# Altium project G38TPS40200CC.PrjPcb
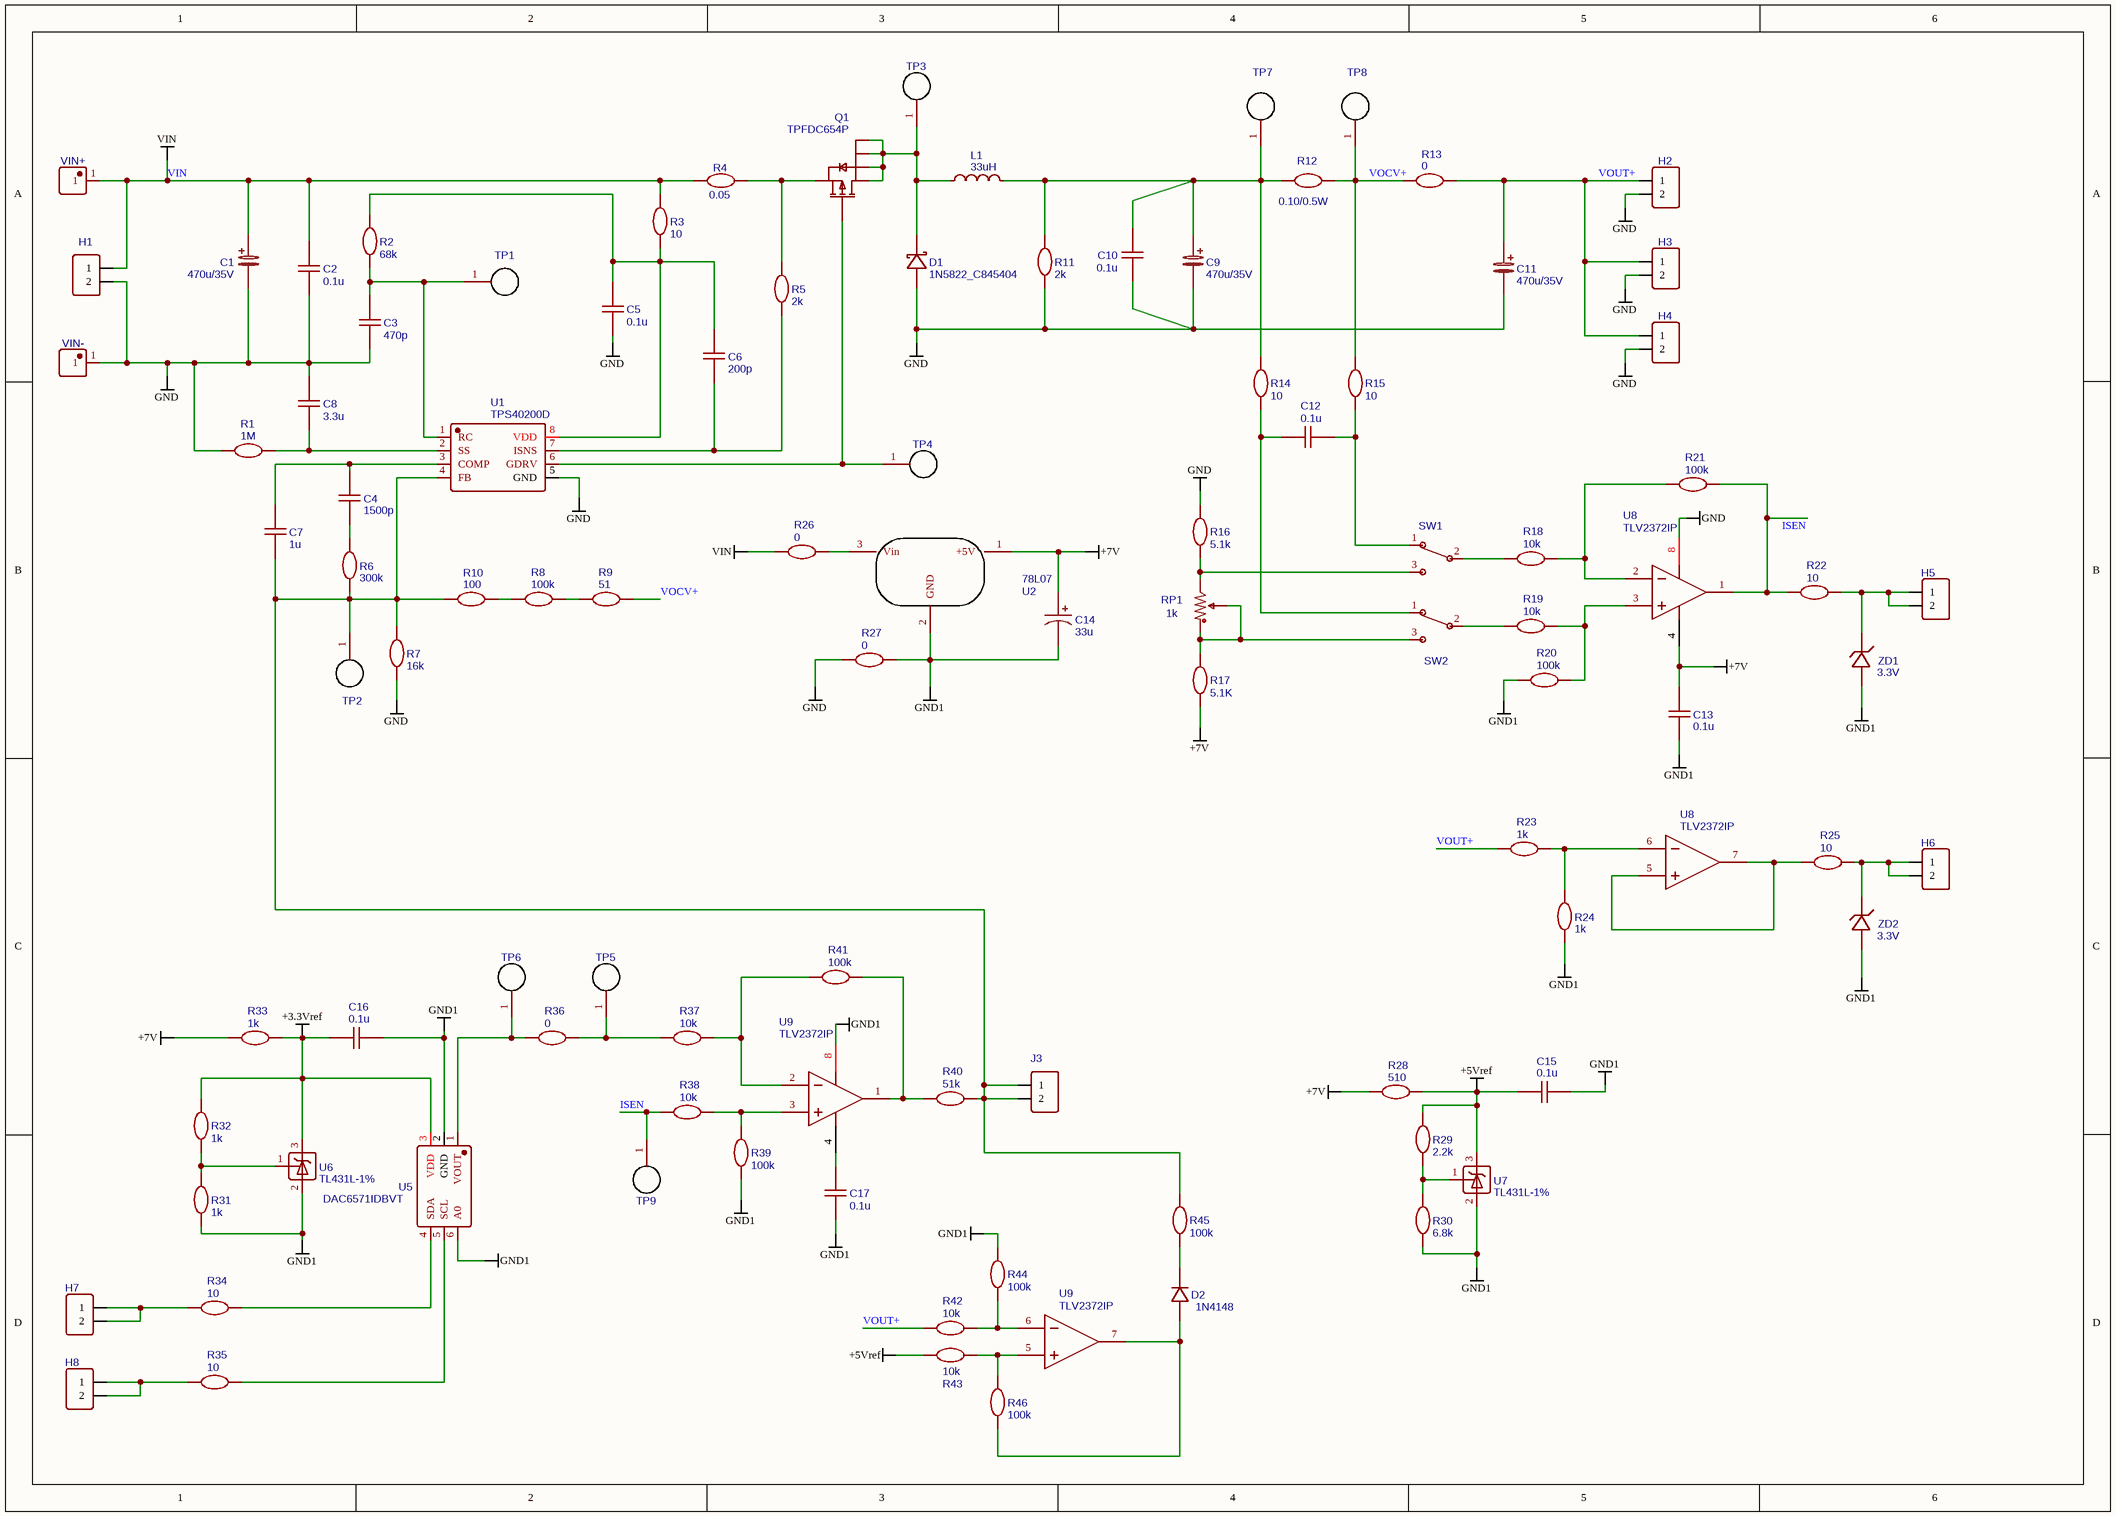
[diagram p0: G38TPS40200CC.schdoc]
1 sheet, 101 parts. Net scope: global (net labels, ports and power ports of the same name join across sheets).
Board file: G38TPS40200CC.pcbdoc

## Sheet G38TPS40200CC.schdoc
size 396 x 283 mm

### Parts
(Parts that share a designator on the sheet are numbered #1, #2 ... from top to bottom, then left to right.)
C1  470u/35V  [470UF/50V]
C2  0.1u  [C0805]
C3  470p  [C0805]
C4  1500p  [C0805]
C5  0.1u  [C0805]
C6  200p  [C0805]
C7  1u  [C0805]
C8  3.3u  [C0805]
C9  470u/35V  [470UF/50V]
C10  0.1u  [C0805]
C11  470u/35V  [470UF/50V]
C12  0.1u  [C0805]
C13  0.1u  [C0805]
C14  33u  [33UF/50V]
C15  0.1u  [C0805]
C16  0.1u  [C0805]
C17  0.1u  [C0805]
D1  1N5822_C845404  [DO-27_BD5.3-L8.4-P12.40-D1.3-RD]
D2  1N4148  [DO-35_BD2.0-L4.2-P8.20-D0.5-RD]
H1  HDR-F-2.54_1x2  [CONN-TH_P5.08_2EDGV-5.08-02P-14-100A-H]  (value not drawn)
H2  HDR-F-2.54_1x2  [CONN-TH_P5.08_2EDGV-5.08-02P-14-100A-H]  (value not drawn)
H3  HDR-F-2.54_1x2  [CONN-TH_P5.08_2EDGV-5.08-02P-14-100A-H]  (value not drawn)
H4  HDR-F-2.54_1x2  [CONN-TH_P5.08_2EDGV-5.08-02P-14-100A-H]  (value not drawn)
H5  HDR-F-2.54_1x2  [HDR-F-2.54_1X2]  (value not drawn)
H6  HDR-F-2.54_1x2  [HDR-F-2.54_1X2]  (value not drawn)
H7  HDR-F-2.54_1x2  [HDR-F-2.54_1X2]  (value not drawn)
H8  HDR-F-2.54_1x2  [HDR-F-2.54_1X2]  (value not drawn)
J3  HDR-F-2.54_1x2  [HDR-F-2.54_1X2]  (value not drawn)
L1  33uH  [IND-SMD_L7.0-W7.0_SMDRI74-330MT]
Q1  TPFDC654P  [SOT-23-6_L2.9-W1.6-P0.95-LS2.8-BL]
R1  1M  [R0805]
R2  68k  [R0805]
R3  10  [R0805]
R4  0.05  [R2512]
R5  2k  [R0805]
R6  300k  [R0805]
R7  16k  [R0805]
R8  100k  [R0805]
R9  51  [R0805]
R10  100  [R0805]
R11  2k  [R0805]
R12  0.10/0.5W  [R2512]
R13  0  [R0805]
R14  10  [R0805]
R15  10  [R0805]
R16  5.1k  [R0805]
R17  5.1K  [R0805]
R18  10k  [R0805]
R19  10k  [R0805]
R20  100k  [R0805]
R21  100k  [R0805]
R22  10  [R0805]
R23  1k  [R0805]
R24  1k  [R0805]
R25  10  [R0805]
R26  0  [R0805]
R27  0  [R0805]
R28  510  [R0805]
R29  2.2k  [R0805]
R30  6.8k  [R0805]
R31  1k  [R0805]
R32  1k  [R0805]
R33  1k  [R0805]
R34  10  [R0805]
R35  10  [R0805]
R36  0  [R0805]
R37  10k  [R0805]
R38  10k  [R0805]
R39  100k  [R0805]
R40  51k  [R0805]
R41  100k  [R0805]
R42  10k  [R0805]
R43  10k  [R0805]
R44  100k  [R0805]
R45  100k  [R0805]
R46  100k  [R0805]
RP1  1k  [RES-ADJ-TH_3P-L9.7-W5.0-P2.54]
SW1  CS12ANW03  [HDR-M-2.54_1X3]  (value not drawn)
SW2  CS12ANW03  [HDR-M-2.54_1X3]  (value not drawn)
TP1  1625854-2  [TESTPOINT-TH_Z2-1.5-8-2.5]  (value not drawn)
TP2  1625854-2  [TESTPOINT-TH_Z2-1.5-8-2.5]  (value not drawn)
TP3  1625854-2  [TESTPOINT-TH_Z2-1.5-8-2.5]  (value not drawn)
TP4  1625854-2  [TESTPOINT-TH_Z2-1.5-8-2.5]  (value not drawn)
TP5  1625854-2  [TESTPOINT-TH_Z2-1.5-8-2.5]  (value not drawn)
TP6  1625854-2  [TESTPOINT-TH_Z2-1.5-8-2.5]  (value not drawn)
TP7  1625854-2  [TESTPOINT-TH_Z2-1.5-8-2.5]  (value not drawn)
TP8  1625854-2  [TESTPOINT-TH_Z2-1.5-8-2.5]  (value not drawn)
TP9  1625854-2  [TESTPOINT-TH_Z2-1.5-8-2.5]  (value not drawn)
U1  TPS40200D  [SOIC-8_L4.9-W3.9-P1.27-LS6.0-BL]
U2  78L07  [TO-92]
U5  DAC6571IDBVT  [SOT-23-6_L2.9-W1.6-P0.95-LS2.8-BL]
U6  TL431L-1%  [TO-92-3_L4.6-W3.6-P1.27-L]
U7  TL431L-1%  [TO-92-3_L4.6-W3.6-P1.27-L]
U8#1  TLV2372IP  [PDIP-8_L9.6-W6.4-P2.54-LS7.9-BL]
U8#2  TLV2372IP  [PDIP-8_L9.6-W6.4-P2.54-LS7.9-BL]
U9#1  TLV2372IP  [PDIP-8_L9.6-W6.4-P2.54-LS7.9-BL]
U9#2  TLV2372IP  [PDIP-8_L9.6-W6.4-P2.54-LS7.9-BL]
VIN+  5012  [BANANA_JACK_1PIN]  (value not drawn)
VIN-  5012  [BANANA_JACK_1PIN]  (value not drawn)
ZD1  3.3V  [DO-41_BD2.8-L4.2-P8.00-D0.7-FD]
ZD2  3.3V  [DO-41_BD2.8-L4.2-P8.00-D0.7-FD]

### Nets
+3.3Vref: C16.1 R32.1 R33.2 U5.3(VDD) U6.3(K)
+5Vref: C15.1 R28.2 R29.1 R43.1 U7.3(K)
+7V: C13.1 C14.1 R17.2 R28.1 R33.1 U2.1(+5V) U8#1.4(GND)
GND: C1.- C2.2 C3.2 C5.2 C8.1 C9.- C10.2 C11.- D1.2(A) H1.2 H2.2 H3.2 H4.2 R1.1 R7.2 R11.2 R16.1 R27.1 U1.5(GND) U8#1.8(VDD) VIN-.1
GND1: C13.2 C14.2 C15.2 C16.2 C17.2 R20.1 R24.2 R27.2 R30.2 R31.2 R39.2 R44.2 U2.2(GND) U5.2(GND) U5.6(A0) U6.2(A) U7.2(A) U9#1.8(VDD) ZD1.1(A) ZD2.1(A)
VIN: C1.+ C2.1 H1.1 R3.1 R4.1 R26.1 VIN+.1
ISEN: R21.2 R22.1 R38.1 TP9.1 U8#1.1(1OUT)
VOCV+: R9.2 R12.2 R13.1 R15.2 TP8.1
VOUT+: C11.+ H2.1 H3.1 H4.1 R13.2 R23.1 R42.1
NetC3_1: C3.1 R2.2 TP1.1 U1.1(RC)
NetC4_1: C4.1 C7.2 U1.3(COMP)
NetC4_2: C4.2 R6.1
NetC5_1: C5.1 C6.1 R2.1 R3.2 U1.8(VDD)
NetC6_2: C6.2 R5.2 U1.7(ISNS)
NetC7_1: C7.1 J3.1 J3.2 R6.2 R7.1 R10.1 R40.2 R45.1 TP2.1 U1.4(FB)
NetC8_2: C8.2 R1.2 U1.2(SS)
NetC9_+: C9.+ C10.1 L1.2 R11.1 R12.1 R14.1 TP7.1
NetC12_1: C12.1 R14.2 SW2.1
NetC12_2: C12.2 R15.1 SW1.1
NetC17_1: C17.1 U9#1.4(GND)
NetD1_1: D1.1(K) L1.1 Q1.1(D) Q1.2(D) Q1.5(D) Q1.6(D) TP3.1
NetD2_1: D2.1 R45.2
NetD2_2: D2.2 R46.2 U9#2.7(2OUT)
NetH5_1: H5.1 H5.2 R22.2 ZD1.2(K)
NetH6_1: H6.1 H6.2 R25.2 ZD2.2(K)
NetH7_1: H7.1 H7.2 R34.1
NetH8_1: H8.1 H8.2 R35.1
NetQ1_3: Q1.3(G) TP4.1 U1.6(GDRV)
NetQ1_4: Q1.4(S) R4.2 R5.1
NetR8_1: R8.1 R10.2
NetR8_2: R8.2 R9.1
NetR16_2: R16.2 RP1.3 SW1.3
NetR17_1: R17.1 RP1.1 RP1.2 SW2.3
NetR18_1: R18.1 SW1.2(COMM)
NetR18_2: R18.2 R21.1 U8#1.2(1IN-)
NetR19_1: R19.1 SW2.2(COMM)
NetR19_2: R19.2 R20.2 U8#1.3(1IN+)
NetR23_2: R23.2 R24.1 U8#2.6(2IN-)
NetR25_1: R25.1 U8#2.5(2IN+) U8#2.7(2OUT)
NetR26_2: R26.2 U2.3(Vin)
NetR29_2: R29.2 R30.1 U7.1(R)
NetR31_1: R31.1 R32.2 U6.1(R)
NetR34_2: R34.2 U5.4(SDA)
NetR35_2: R35.2 U5.5(SCL)
NetR36_1: R36.1 TP6.1 U5.1(VOUT)
NetR36_2: R36.2 R37.1 TP5.1
NetR37_2: R37.2 R41.1 U9#1.2(1IN-)
NetR38_2: R38.2 R39.1 U9#1.3(1IN+)
NetR40_1: R40.1 R41.2 U9#1.1(1OUT)
NetR42_2: R42.2 R44.1 U9#2.6(2IN-)
NetR43_2: R43.2 R46.1 U9#2.5(2IN+)

### Library data of the parts
C1 C9 C11 = 470u/35V: nameAlias: Value(F); Contributor: LCEDA_Lib; spicePre: C; spiceSymbolName: C_Tan_SMD_A_EU
C2 C5 C10 C12 C13 C15-C17 = 0.1u: nameAlias: Value(F); Contributor: LCEDA_Lib; spicePre: C
  C2 C5 C10: spiceSymbolName: C_0603_US
  C12 C13 C15-C17: spiceSymbolName: C_0805_US
C3 = 470p: nameAlias: Value(F); Contributor: LCEDA_Lib; spicePre: C; spiceSymbolName: C_0603_US
C4 = 1500p: nameAlias: Value(F); Contributor: LCEDA_Lib; spicePre: C; spiceSymbolName: C_0603_US
C6 = 200p: nameAlias: Value(F); Contributor: LCEDA_Lib; spicePre: C; spiceSymbolName: C_0603_US
C7 = 1u: nameAlias: Value(F); Contributor: LCEDA_Lib; spicePre: C; spiceSymbolName: C_0603_US
C8 = 3.3u: nameAlias: Value(F); Contributor: LCEDA_Lib; spicePre: C; spiceSymbolName: C_0603_US
C14 = 33u: nameAlias: Value(F); Contributor: LCEDA_Lib; spicePre: C; spiceSymbolName: C_Tan_SMD_A_US
D1 = 1N5822_C845404: BOM_Manufacturer Part: 1N5822; Contributor: LCSC; BOM_Supplier: LCSC; BOM_Supplier Part: C845404; BOM_JLCPCB Part Class: Extended Part; spicePre: D; spiceSymbolName: 1N5822_C845404
D2 = 1N4148: BOM_Manufacturer: STMicroelectronics; Contributor: LCSC; BOM_Supplier: LCSC; BOM_Supplier Part: C13769; BOM_Manufacturer Part: 1N4148; spicePre: D; spiceSymbolName: 1N4148
H1-H8 J3 = HDR-F-2.54_1x2: Contributor: LCEDA_Lib; BOM_Supplier Part: C49661; BOM_Supplier: LCSC; spicePre: H; spiceSymbolName: HDR-F-2.54_1x2
L1 = 33uH: BOM_Manufacturer Part: SMDRI74-330MT; nameAlias: Inductance; BOM_Supplier: LCSC; BOM_Supplier Part: C49625; BOM_JLCPCB Part Class: Extended Part; spicePre: L; spiceSymbolName: SMDRI74-330MT
Q1 = TPFDC654P: Contributor: lcsc; BOM_Supplier: LCSC; BOM_Supplier Part: C5246409; BOM_Manufacturer Part: TPFDC654P; link: https://atta.szlcsc.com/upload/public/pdf/source/20221103/A89DD7696F31491652C9E5A0C36A9DE5.pdf; spicePre: Q; spiceSymbolName: TPFDC654P
R1 = 1M: Contributor: LCEDA_Lib; spicePre: R; spiceSymbolName: R_0603_EU
R2 = 68k: Contributor: LCEDA_Lib; Package Display: No; spicePre: R; spiceSymbolName: R_0603_EU
R3 R14 R15 R22 R25 R34 R35 = 10: Contributor: LCEDA_Lib; spicePre: R
  R3: spiceSymbolName: R_0603_EU
  R14 R15 R22 R25 R34 R35: spiceSymbolName: R_0805_EU
R4 = 0.05: Contributor: LCEDA_Lib; spicePre: R; spiceSymbolName: R_0603_EU
R5 = 2k: Contributor: LCEDA_Lib; spicePre: R; spiceSymbolName: R_0603_EU
R6 = 300k: Contributor: LCEDA_Lib; spicePre: R; spiceSymbolName: R_0603_EU
R7 = 16k: Contributor: LCEDA_Lib; spicePre: R; spiceSymbolName: R_0603_EU
R8 R20 R21 R39 R41 R44-R46 = 100k: Contributor: LCEDA_Lib; spicePre: R
  R8: spiceSymbolName: R_0603_EU
  R20 R21 R39 R41 R44-R46: spiceSymbolName: R_0805_EU
R9 = 51: Contributor: LCEDA_Lib; spicePre: R; spiceSymbolName: R_0603_EU
R10 = 100: Contributor: LCEDA_Lib; spicePre: R; spiceSymbolName: R_0603_EU
R11 = 2k: BOM_Manufacturer Part: SCR0603J750K; Contributor: lcsc; nameAlias: Resistance; BOM_Supplier: LCSC; BOM_Supplier Part: C3017674; spicePre: R; spiceSymbolName: SCR0603J750K
R12 = 0.10/0.5W: Contributor: LCEDA_Lib; spicePre: R; spiceSymbolName: R_2512_EU
R13 R26 R27 R36 = 0: Contributor: LCEDA_Lib; spicePre: R; spiceSymbolName: R_0805_EU
R16 = 5.1k: Contributor: LCEDA_Lib; spicePre: R; spiceSymbolName: R_0805_EU
R17 = 5.1K: Contributor: LCEDA_Lib; spicePre: R; spiceSymbolName: R_0805_EU
R18 R19 R37 R38 R42 R43 = 10k: Contributor: LCEDA_Lib; spicePre: R; spiceSymbolName: R_0805_EU
R23 R24 R31-R33 = 1k: Contributor: LCEDA_Lib; spicePre: R; spiceSymbolName: R_0805_EU
R28 = 510: Contributor: LCEDA_Lib; spicePre: R; spiceSymbolName: R_0805_EU
R29 = 2.2k: Contributor: LCEDA_Lib; spicePre: R; spiceSymbolName: R_0805_EU
R30 = 6.8k: Contributor: LCEDA_Lib; spicePre: R; spiceSymbolName: R_0805_EU
R40 = 51k: Contributor: LCEDA_Lib; spicePre: R; spiceSymbolName: R_0805_EU
RP1 = 1k: nameAlias: Value; Contributor: LCEDA_Lib; BOM_Supplier: LCSC; spicePre: R; spiceSymbolName: R_3386P_US
SW1 SW2 = CS12ANW03: BOM_Manufacturer: NKK Switches; Contributor: lcsc; BOM_Supplier: LCSC; BOM_Supplier Part: C3664631; BOM_Manufacturer Part: CS12ANW03; spicePre: U; spiceSymbolName: CS12ANW03
TP1-TP9 = 1625854-2: Contributor: LCSC; BOM_Supplier: LCSC; BOM_Supplier Part: C306063; BOM_Manufacturer Part: 1625854-2; BOM_JLCPCB Part Class: Extended Part; spicePre: U; spiceSymbolName: 1625854-2
U1 = TPS40200D: Contributor: lcsc; BOM_Supplier: LCSC; BOM_Supplier Part: C1530060; BOM_Manufacturer Part: TPS40200D; link: https://atta.szlcsc.comnull; BOM_JLCPCB Part Class: Extended Part; spicePre: U; spiceSymbolName: TPS40200D
U2 = 78L07: Contributor: Michael-Sun; spicePre: U; spiceSymbolName: 78L07
U5 = DAC6571IDBVT: Contributor: LCSC; BOM_Supplier: LCSC; BOM_Supplier Part: C1554794; BOM_Manufacturer Part: DAC6571IDBVT; BOM_JLCPCB Part Class: Extended Part; spicePre: U; spiceSymbolName: DAC6571IDBVT
U6 U7 = TL431L-1%: Contributor: LCSC; BOM_Supplier: LCSC; BOM_Supplier Part: C2874179; BOM_Manufacturer Part: TL431L-1%; BOM_JLCPCB Part Class: Extended Part; spicePre: U; spiceSymbolName: TL431L-1%
U8#1 U8#2 U9#1 U9#2 = TLV2372IP: subpart_no: 1; BOM_Supplier: LCSC; BOM_Supplier Part: C2878991; BOM_Manufacturer Part: TLV2372IP; link: https://atta.szlcsc.comnull; spicePre: U; spiceSymbolName: TLV2372IP
VIN+ VIN- = 5012: BOM_Manufacturer: Keystone; Contributor: lcsc; BOM_Supplier: LCSC; BOM_Supplier Part: C2906766; BOM_Manufacturer Part: 5012; BOM_JLCPCB Part Class: Extended Part; spicePre: C; spiceSymbolName: 5012
ZD1 ZD2 = 3.3V: BOM_Manufacturer Part: 1N4728A; BOM_Supplier: LCSC; BOM_Supplier Part: C2531; BOM_JLCPCB Part Class: Extended Part; spicePre: Z; spiceSymbolName: 1N4728A